# Altium schematic sheet ADCs.SchDoc
size A4
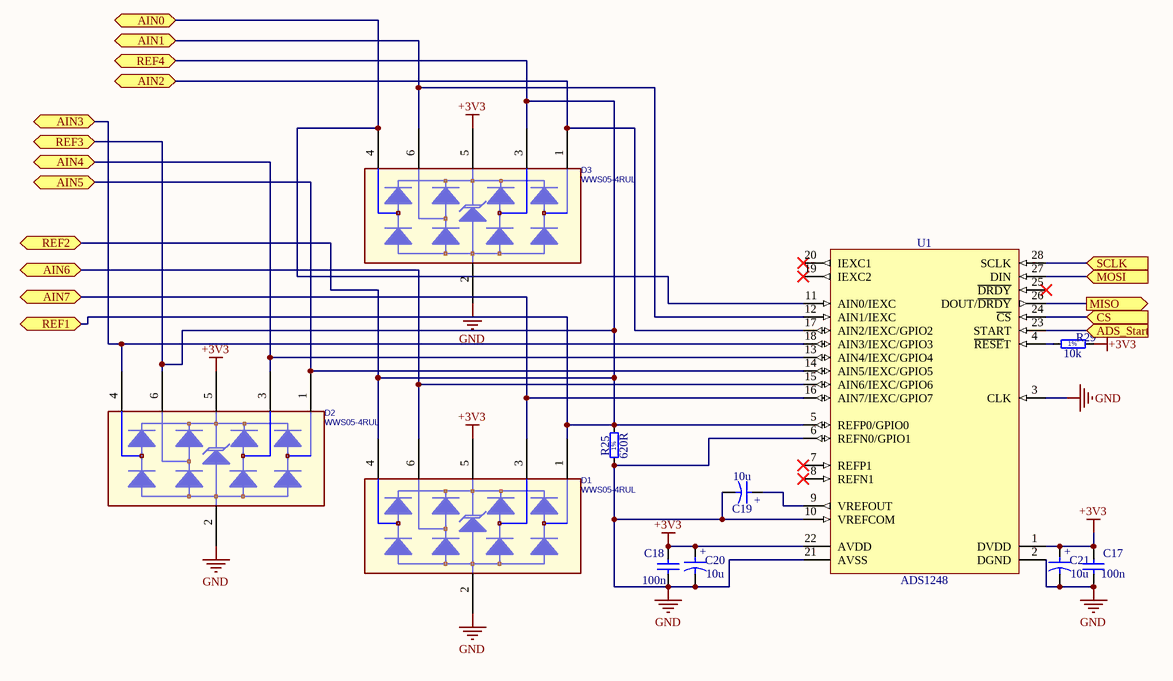
[diagram p0: ADCs.SchDoc]

## Parts
C17  100n  [CAPC1005X55N]
C18  100n  [CAPC1005X55N]
C19  10u  [CAPMP3216X180N]
C20  10u  [CAPMP3216X180N]
C21  10u  [CAPMP3216X180N]
D1  WWS05-4RUL  [SOT23-6]
D2  WWS05-4RUL  [SOT23-6]
D3  WWS05-4RUL  [SOT23-6]
R25  620R  [RESC1005X40N]
R29  10k  [RESC1005X40N]
U1  ADS1248  [SOP65P640X120-28N]

## Ports
ADS_Start (in), AIN0, AIN1, AIN2, AIN3, AIN4, AIN5, AIN6, AIN7, CS (in), MISO (out), MOSI (in), REF1, REF2, REF3, REF4, SCLK (in)

## Nets
+3V3: C17.2 C18.2 C20.1 C21.1 D1.5 D2.5 D3.5 R29.2 U1.1(DVDD) U1.22(AVDD)
GND: C17.1 C18.1 C19.2 C20.2 C21.2 D1.2 D2.2 D3.2 R25.1 U1.2(DGND) U1.3(CLK) U1.6(REFN0/GPIO1) U1.10(VREFCOM) U1.21(AVSS)
ADS_Start: U1.23(START) ; port ADS_Start
AIN0: D3.4 U1.11(AIN0/IEXC) ; port AIN0
AIN1: D3.6 U1.12(AIN1/IEXC) ; port AIN1
AIN2: D3.1 U1.17(AIN2/IEXC/GPIO2) ; port AIN2
AIN3: D2.4 U1.18(AIN3/IEXC/GPIO3) ; port AIN3
AIN4: D2.3 U1.13(AIN4/IEXC/GPIO4) ; port AIN4
AIN5: D2.1 U1.14(AIN5/IEXC/GPIO5) ; port AIN5
AIN6: D1.6 U1.15(AIN6/IEXC/GPIO6) ; port AIN6
AIN7: D1.3 U1.16(AIN7/IEXC/GPIO7) ; port AIN7
CS: U1.24(~{CS}) ; port CS
MISO: U1.26(DOUT/~{DRDY}) ; port MISO
MOSI: U1.27(DIN) ; port MOSI
REF1: D1.1 D1.4 D2.6 D3.3 R25.2 U1.5(REFP0/GPIO0) ; port REF1, port REF2, port REF3, port REF4
SCLK: U1.28(SCLK) ; port SCLK
NetC19_1: C19.1 U1.9(VREFOUT)
NetR29_1: R29.1 U1.4(~{RESE}T)

Not connected (* = marked no-connect by the designer): U1 7(REFP1)* 8(REFN1)* 19(IEXC2)* 20(IEXC1)* 25(~{DRDY})*

## Notes on the sheet
- (in symbol CTE7343-31_10UF_25V_10%) +
- (in symbol R0402_10K_1%_0.0625W_100PPM) 1%
- (in symbol R0402_620R_1%_0.0625W_100PPM) 1%

## Library data of the parts
C17 C18 = CC0402_100NF_16V_10%_X7R: Non-polarised capacitor; Part Description: SMD Multilayer Chip Ceramic Capacitor; Manufacturer: GENERIC; Manufacturer1 Part Number: 223878715649; Value: 100nF; Voltage: 16V; TC: X7R; Tolerance: ±10%; Table: Capacitors SMD; Part Number: CC0402_100NF_16V_10%_X7R; Component Kind: Standard; Component Type: Standard; Pin Count: 2; Status: Not Recommended; Manufacturer Part Number: CC0402_100NF_16V_10%_X7R; Case: 0402; Mounted: Yes; Socket: No; SMD: Yes; Manufacturer1 Example: PHYCOMP; Manufacturer1 ComponentHeight: 0.55mm; HelpURL: \\cern.ch\dfs\Applications\Altium\Datasheets\CC0402_X7R_PHYCOMP.pdf; Author: CERN DEM JLC; CreateDate: 2007-12-03; LatestRevisionDate: 2007-12-03
C19-C21 = CTE7343-31_10UF_25V_10%: Polarised capacitor; Part Description: Solid Tantalum Chip Capacitor; Manufacturer: GENERIC; Manufacturer1 Part Number: TAJD106K025R; Value: 10uF; Voltage: 25V; Tolerance: ±10%; Table: Capacitors SMD; Part Number: CTE7343-31_10UF_25V_10%; Component Kind: Standard; Component Type: Standard; Footprint: CAPMP7343X310N; Pin Count: 2; Status: Preferred; Manufacturer Part Number: CTE7343-31_10UF_25V_10%; Case: D; Mounted: Yes; Socket: No; SMD: Yes; Manufacturer1 Example: AVX; Manufacturer1 ComponentHeight: 3.1mm; HelpURL: \\cern.ch\dfs\Applications\Altium\Datasheets\CTE_AVX_TAJ.pdf; Author: CERN DEM JMW; CreateDate: 2008-10-17; LatestRevisionDate: 2008-10-17
D1-D3 = D_TVS_WWS05-4RUL: TVS, 5V; Specification: SMD,ESD COMPONENT,ROHS; Description: DIODE,RCLAMP0524P,SEMTECH
R25 = R0402_620R_1%_0.0625W_100PPM: Resistor - 1%; Part Description: General Purpose Thick Film Chip Resistor; Manufacturer: GENERIC; Manufacturer1 Part Number: 232270676201L; Value: 620; TC: ±100ppm/°C; Table: Resistors SMD; Part Number: R0402_620R_1%_0.0625W_100PPM; Component Kind: Standard; Component Type: Standard; Pin Count: 2; Status: Not recommended; Power: 0.0625W; Tolerance: ±1%; Manufacturer Part Number: R0402_620R_1%_0.0625W_100PPM; Case: 0402; Mounted: Yes; Socket: No; SMD: Yes; Manufacturer1 Example: YAGEO PHYCOMP; Manufacturer1 ComponentHeight: 0.4mm; HelpURL: \\cern.ch\dfs\Applications\Altium\Datasheets\R0402_Phycomp_RC0402.pdf; Author: CERN DEM JLC; CreateDate: 2007-12-03; LatestRevisionDate: 2012-10-17
R29 = R0402_10K_1%_0.0625W_100PPM: Resistor - 1%; Part Description: General Purpose Thick Film Chip Resistor; Manufacturer: GENERIC; Manufacturer1 Part Number: 232270671003L; TC: ±100ppm/°C; Table: Resistors SMD; Part Number: R0402_10K_1%_0.0625W_100PPM; Component Kind: Standard; Component Type: Standard; Pin Count: 2; Value: 10k; Status: Not recommended; Power: 0.0625W; Tolerance: ±1%; Manufacturer Part Number: R0402_10K_1%_0.0625W_100PPM; Case: 0402; Mounted: Yes; Socket: No; SMD: Yes; Manufacturer1 Example: YAGEO PHYCOMP; Manufacturer1 ComponentHeight: 0.4mm; HelpURL: \\cern.ch\dfs\Applications\Altium\Datasheets\R0402_Phycomp_RC0402.pdf; Author: CERN DEM JLC; CreateDate: 2007-12-03; LatestRevisionDate: 2012-10-17
U1 = ADS1248IPWR: 24-Bit Analog-to-Digital Converter for Temperature Sensors; Manufacturer: TEXAS INSTRUMENTS; Table: Analog & Interface; Part Number: ADS1248IPWR; Component Kind: Standard; Component Type: Standard; Device: ADS1248IPWR; PackageDescription: SOP, 0.65mm Pitch; 28 Pin, 4.40mm W X 9.70mm L X 1.20mm H body, IPC Medium Density; Part Description: 24-Bit Analog-to-Digital Converter for Temperature Sensors; Manufacturer Part Number: ADS1248IPWR; Pin Count: 28; Case: TSSOP28; Mounted: Yes; Socket: No; SMD: Yes; ComponentHeight: 1.2mm; Author: CERN DEM JLC; HelpURL: \\cern.ch\dfs\Applications\Altium\Datasheets\ADS1248IPWR.pdf; CreateDate: 2012-03-19; LatestRevisionDate: 2012-03-19